# EasyEDA Pro project musclemap_pcb_header.eprj, board PCB2
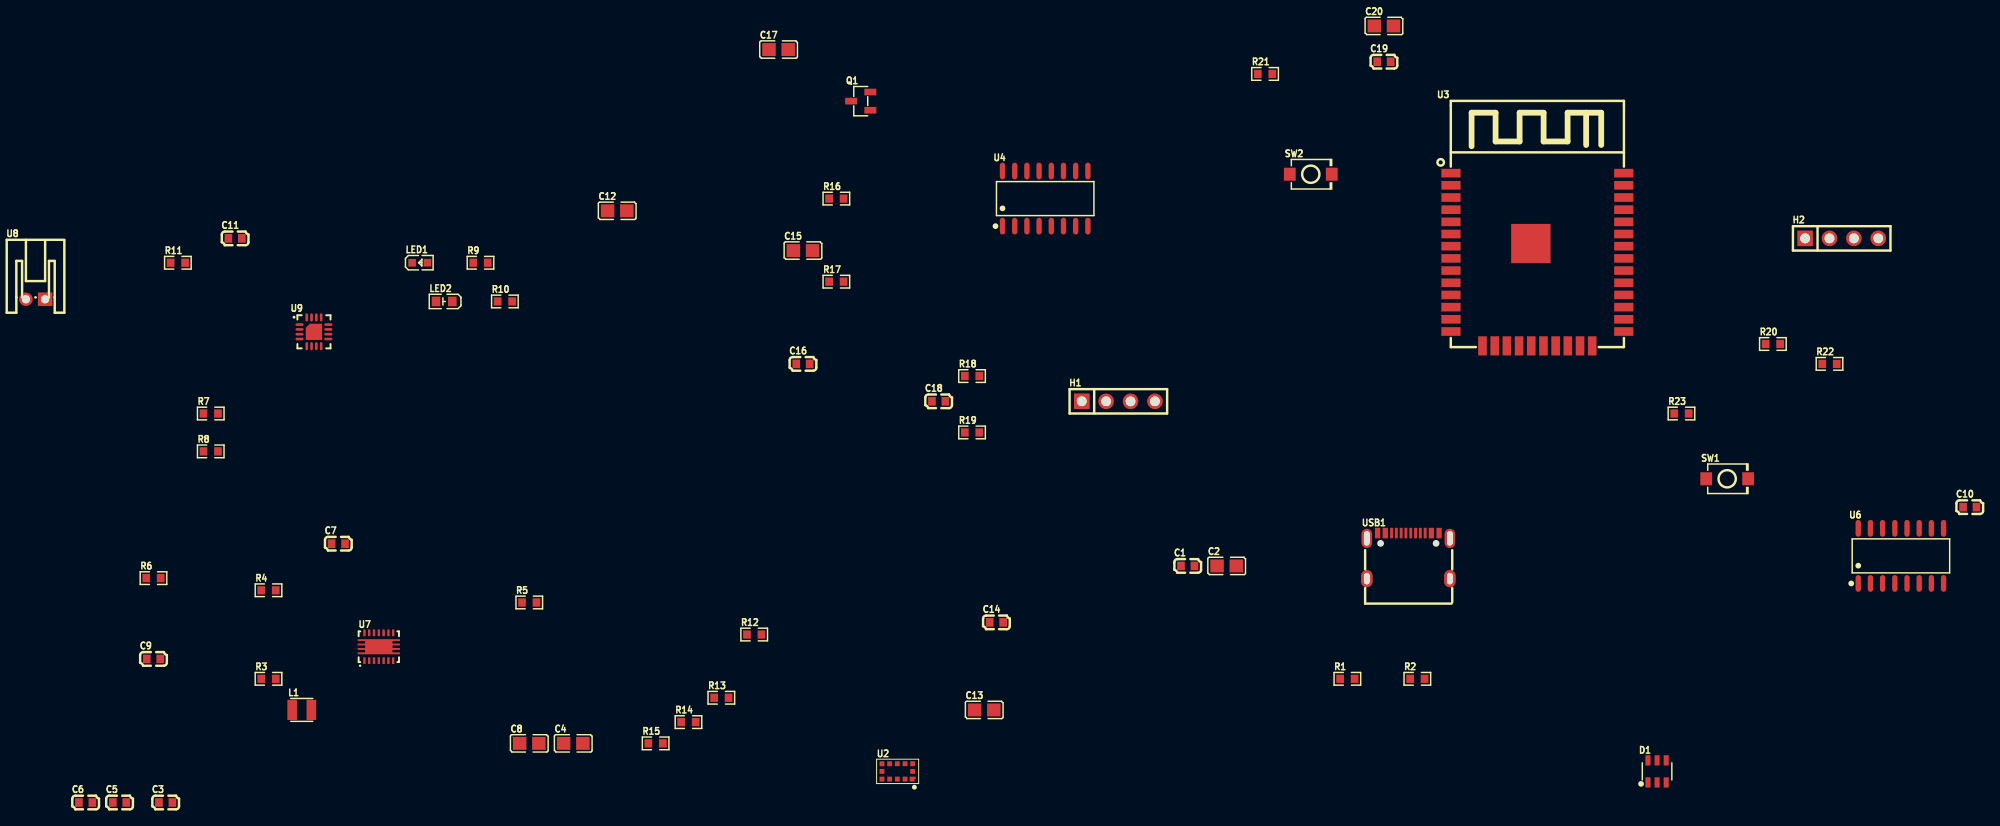
[diagram p3: board, top side]
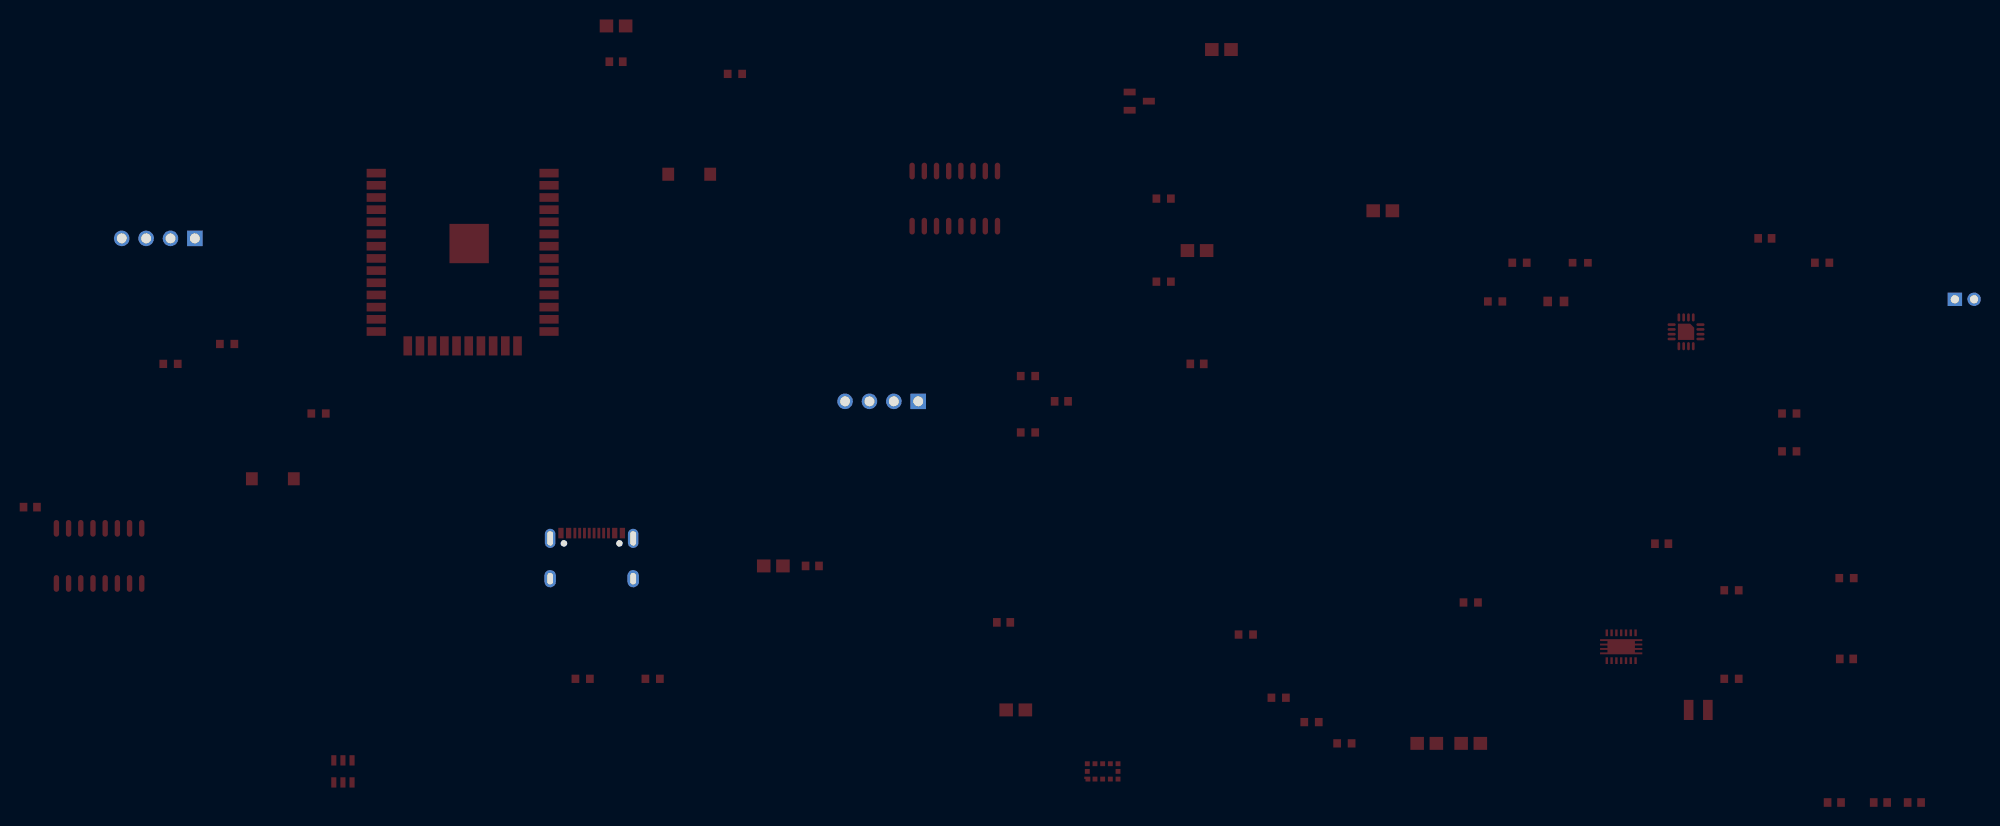
[diagram p4: board, bottom side, seen from below]

Outline 6.47 x 0.69 mm; copper layers: Top Layer, Bottom Layer. Coordinates in mm from the lower left corner of the outline.
Stack: Top Layer 0.035mm / Dielectric1 1.51mm FR4 er 4.5 / Bottom Layer 0.035mm

## Design rules (mm)
template: JLCPCB Capability(Two Layers Board)
spacing copperThickness1oz (default): track to track 0.102, other pairs 0.152 to 0.3
spacing copperThickness2oz: track to track 0.203, other pairs 0.152 to 0.3
track width copperThickness1oz (default): min 0.127, default 0.254, max 2.54
track width copperThickness2oz: min 0.203, default 0.254, max 2.54
differential pair differentialPair (default): width min 0.127, default 0.254, max 2.54; gap min 0.152, default 0.152
via viaSize (default): diameter min 0.5, default 0.61, max 10; hole min 0.3, default 0.305, max 6.3

## Placement (name value [footprint] x y rotation side)
C1  100nF  [C0603]  -19.74 -2 0 top
C2  10uF  [C0805]  -15.68 -2 0 top
C3  22uF  [C0603]  -126.19 -26.67 0 top
C4  10uF  [C0805]  -83.74 -20.5 0 top
C5  22uF  [C0603]  -131 -26.67 0 top
C6  22uF  [C0603]  -134.53 -26.67 0 top
C7  100nF  [C0603]  -108.21 0.31 0 top
C8  10uF  [C0805]  -88.32 -20.5 0 top
C9  4.7pF  [C0603]  -127.46 -11.7 0 top
C10  100nF  [C0603]  61.71 4.12 0 top
C11  1uF  [C0603]  -118.96 32.14 0 top
C12  4.7uF  [C0805]  -79.16 35.02 0 top
C13  4.7uF  [C0805]  -40.94 -17.02 0 top
C14  100nF  [C0603]  -39.67 -7.89 0 top
C15  10uF  [C0805]  -59.82 30.87 0 top
C16  100nF  [C0603]  -59.82 19.06 0 top
C17  10uF  [C0805]  -62.36 51.83 0 top
C18  100nF  [C0603]  -45.68 15.16 0 top
C19  100nF  [C0603]  0.7 50.56 0 top
C20  10uF  [C0805]  0.7 54.29 0 top
D1  USBLC6-2SC6  [SOT-23-6_L2.9-W1.6-P0.95-LS2.8-BL]  29.14 -23.42 0 top
H1  HX PH254-01-04-Z-L11.5 straight pin header  [HDR-TH_4P-HX-PH254-01-04-Z-L11.5]  -26.97 15.16 0 top
H2  HX PH254-01-04-Z-L11.5 straight pin header  [HDR-TH_4P-HX-PH254-01-04-Z-L11.5]  48.38 32.14 0 top
L1  1.5uH  [IND-SMD_L2.5-W2.0_MEKK2520TR47M]  -112.02 -17.02 0 top
LED1  XL-1608SURC-06  [LED0603-RD_RED]  -99.73 29.6 0 top
LED2  YLED0603B  [LED0603-FD]  -97.19 25.57 0 top
Q1  BC807-40,215  [SOT-23-3_L2.9-W1.3-P1.90-LS2.4-BR]  -53.8 46.45 0 top
R1  5.1kΩ  [R0603]  -3.11 -13.77 0 top
R2  5.1kΩ  [R0603]  4.18 -13.77 0 top
R3  180kΩ  [R0603]  -115.48 -13.77 0 top
R4  1MΩ  [R0603]  -115.48 -4.54 0 top
R5  1MΩ  [R0603]  -88.32 -5.81 0 top
R6  68kΩ  [R0603]  -127.46 -3.27 0 top
R7  1.18kΩ  [R0603]  -121.5 13.89 0 top
R8  1.13kΩ  [R0603]  -121.5 9.94 0 top
R9  1kΩ  [R0603]  -93.4 29.6 0 top
R10  1kΩ  [R0603]  -90.86 25.57 0 top
R11  10kΩ  [R0603]  -124.92 29.6 0 top
R12  3.6kΩ  [R0603]  -64.9 -9.16 0 top
R13  3.6kΩ  [R0603]  -68.32 -15.75 0 top
R14  3.6kΩ  [R0603]  -71.74 -18.29 0 top
R15  3.6kΩ  [R0603]  -75.16 -20.5 0 top
R16  20kΩ  [R0603]  -56.34 36.29 0 top
R17  8.2kΩ  [R0603]  -56.34 27.63 0 top
R18  100Ω  [R0603]  -42.21 17.79 0 top
R19  100Ω  [R0603]  -42.21 11.91 0 top
R20  10kΩ  [R0603]  41.21 21.13 0 top
R21  10kΩ  [R0603]  -11.68 49.29 0 top
R22  10kΩ  [R0603]  47.11 19.06 0 top
R23  10kΩ  [R0603]  31.68 13.89 0 top
SW1  TS-1088-AR02016  [SW-SMD_L3.9-W3.0-P4.45]  36.45 7.08 0 top
SW2  TS-1088-AR02016  [SW-SMD_L3.9-W3.0-P4.45]  -6.92 38.83 0 top
U2  VL53L4CDV0DH/1  [LGA-12_L4.4-W2.4_VL53L0X]  -49.99 -23.42 0 top
U3  ESP32-WROOM-32-N4  [WIFIM-SMD_ESP32-WROOM-32-N4]  16.68 29.94 0 top
U4  HX711  [SOP-16_L10.0-W3.9-P1.27-LS6.0-BL]  -34.59 36.29 0 top
U6  CH340C  [SOP-16_L10.0-W3.9-P1.27-LS6.0-BL]  54.54 -0.96 0 top
U7  TPS63020DSJT  [VSON-14_L4.0-W3.0-P0.50-BL-EP_TI_DSJ]  -103.99 -10.43 0 top
U8  S2B-PH-K-S(LF)(SN)  [CONN-TH_S2B-PH-K-S-LF-SN]  -139.75 25.79 0 top
U9  BQ24075RGTR  [QFN-16_L3.0-W3.0-P0.50-TL-EP1.7]  -110.75 22.4 0 top
USB1  TYPE-C 16PIN 2MD(073)  [USB-C-SMD_TYPE-C-6PIN-2MD-073]  3.24 -0.96 0 top

## Footprints (pads in the part's own frame, mm; a bottom-side part is the same pattern mirrored in y, then rotated)
C0603
  rect 0.8x0.9 smd: 1(-0.7,0) 2(0.7,0)
C0805
  rect 1.41x1.35 smd: 1(-1,0) 2(1,0)
CONN-TH_S2B-PH-K-S-LF-SN
  rect 1.5x1.4 hole 0.85: 1(1,0)
  round 1.4 hole 0.85: 2(-1,0)
HDR-TH_4P-HX-PH254-01-04-Z-L11.5
  rect 1.62x1.62 hole 1.02: 1(-3.81,0)
  round 1.62 hole 1.02: 2(-1.27,0) 3(1.27,0) 4(3.81,0)
IND-SMD_L2.5-W2.0_MEKK2520TR47M
  rect 1x2.1 smd: 1(1,0) 2(-1,0)
LED0603-FD
  rect 0.9x1 smd: 1(-0.85,0) 2(0.85,0)
LED0603-RD_RED
  rect 0.8x0.8 smd: 1(-0.799,-0.004) 2(0.799,0.004)
LGA-12_L4.4-W2.4_VL53L0X
  custom 0.635x0.508 smd: 1(1.6,-0.8)
  rect 0.508x0.508 smd: 2(0.8,-0.8) 3(0,-0.8) 4(-0.8,-0.8) 5(-1.6,-0.8) 6(-1.6,0) 7(-1.6,0.8) 8(-0.8,0.8) 9(0,0.8) 10(0.8,0.8) 11(1.6,0.8) 12(1.6,0)
QFN-16_L3.0-W3.0-P0.50-TL-EP1.7
  oval 0.85x0.28 smd: 1(-1.5,0.75) 2(-1.5,0.25) 3(-1.5,-0.25) 4(-1.5,-0.75) 9(1.5,-0.75) 10(1.5,-0.25) 11(1.5,0.25) 12(1.5,0.75)
  oval 0.28x0.85 smd: 5(-0.75,-1.5) 6(-0.25,-1.5) 7(0.25,-1.5) 8(0.75,-1.5) 13(0.75,1.5) 14(0.25,1.5) 15(-0.25,1.5) 16(-0.75,1.5)
  custom 1.7x1.7 smd: 17(0,0)
R0603
  rect 0.806x0.864 smd: 1(-0.753,0) 2(0.753,0)
SOP-16_L10.0-W3.9-P1.27-LS6.0-BL
  oval 0.56x1.745 smd: 1(-4.445,-2.873) 2(-3.175,-2.873) 3(-1.905,-2.873) 4(-0.635,-2.873) 5(0.635,-2.873) 6(1.905,-2.873) 7(3.175,-2.873) 8(4.445,-2.873) 9(4.445,2.873) 10(3.175,2.873) 11(1.905,2.873) 12(0.635,2.873) 13(-0.635,2.873) 14(-1.905,2.873) 15(-3.175,2.873) 16(-4.445,2.873)
SOT-23-3_L2.9-W1.3-P1.90-LS2.4-BR
  rect 1.25x0.7 smd: 1(1,-0.95) 2(1,0.95) 3(-1,0)
SOT-23-6_L2.9-W1.6-P0.95-LS2.8-BL
  rect 0.532x1.072 smd: 1(-0.95,-1.149) 2(0,-1.149) 3(0.95,-1.149) 4(0.95,1.149) 5(0,1.149) 6(-0.95,1.149)
SW-SMD_L3.9-W3.0-P4.45
  rect 1.23x1.36 smd: 1(-2.185,0) 2(2.185,0)
USB-C-SMD_TYPE-C-6PIN-2MD-073
  rect 0.55x1.1 smd: 1(-3.2,2.375) 2(-2.4,2.375) 11(2.4,2.375) 12(3.2,2.375)
  rect 0.3x1.1 smd: 3(-1.75,2.375) 4(-1.25,2.375) 5(-0.75,2.375) 6(-0.25,2.375) 7(0.25,2.375) 8(0.75,2.375) 9(1.25,2.375) 10(1.75,2.375)
  oval 1.1x2 hole 0.6x1.5: 13(-4.325,1.825) 14(4.325,1.825)
  oval 1.2x1.8 hole 0.6x1.2: 13(-4.325,-2.375) 14(4.325,-2.375)
VSON-14_L4.0-W3.0-P0.50-BL-EP_TI_DSJ
  rect 0.25x0.7 smd: 1(-1.5,-1.45) 2(-1,-1.45) 3(-0.5,-1.45) 4(0,-1.45) 5(0.5,-1.45) 6(1,-1.45) 7(1.5,-1.45) 8(1.5,1.45) 9(1,1.45) 10(0.5,1.45) 11(0,1.45) 12(-0.5,1.45) 13(-1,1.45) 14(-1.5,1.45)
  custom 4.4x1.58 smd: 15(0,0)
WIFIM-SMD_ESP32-WROOM-32-N4
  rect 2x0.9 smd: 1(-9,9.005) 2(-9,7.735) 3(-9,6.465) 4(-9,5.195) 5(-9,3.925) 6(-9,2.655) 7(-9,1.385) 8(-9,0.115) 9(-9,-1.155) 10(-9,-2.425) 11(-9,-3.695) 12(-9,-4.965) 13(-9,-6.235) 14(-9,-7.505) 25(9,-7.505) 26(9,-6.235) 27(9,-4.965) 28(9,-3.695) 29(9,-2.425) 30(9,-1.155) 31(9,0.115) 32(9,1.385) 33(9,2.655) 34(9,3.925) 35(9,5.195) 36(9,6.465) 37(9,7.735) 38(9,9.005)
  rect 0.9x2 smd: 15(-5.715,-9.005) 16(-4.445,-9.005) 17(-3.175,-9.005) 18(-1.905,-9.005) 19(-0.635,-9.005) 20(0.635,-9.005) 21(1.905,-9.005) 22(3.175,-9.005) 23(4.445,-9.005) 24(5.715,-9.005)
  rect 4.1x4.1 smd: 39(-0.68,1.665)

## Nets
3.3V: C3.2 C5.2 C6.2 C10.1 C13.2 C14.2 C19.1 C20.1 H2.4 R4.2 R5.2 R6.2 R12.2 R13.2 R14.2 R15.2 R20.2 R21.1 R22.2 U2.1 U2.11 U3.2 U6.16 U7.4 U7.5
GND: C1.1 C2.1 C3.1 C4.2 C5.1 C6.1 C7.2 C8.2 C10.2 C11.1 C12.1 C13.1 C14.1 C15.1 C16.2 C17.2 C19.2 C20.2 D1.2 H1.2 H2.1 H2.3 R1.1 R2.1 R3.1 R7.1 R8.1 R11.1 R17.1 R23.1 SW1.1 SW2.1 U2.2 U2.3 U2.4 U2.6 U2.12 U3.1 U3.15 U3.38 U3.39 U4.5 U4.9 U4.10 U4.15 U6.1 U7.2 U7.15 U8.2 U9.4 U9.6 U9.8 U9.14 USB1.1 USB1.12 USB1.13 USB1.14
VBUS: C1.2 C2.2 C11.2 D1.5 U9.13 USB1.2 USB1.11
32: U3.8 U4.11
34: U3.6 U4.12
D+: D1.3 USB1.6 USB1.8
D+_U: D1.4 U6.5
D-: D1.1 USB1.5 USB1.7
D-_U: D1.6 U6.6
RX: U3.34 U6.2
SCL: R15.1 U2.10 U3.36
SDA: R14.1 U2.9 U3.33
TX: U3.35 U6.3
VOUT: C4.1 C8.1 C12.2 R9.2 R10.2 U7.10 U7.11 U9.5 U9.10 U9.11
XSHUT: R12.1 U2.5 U3.10
$1N1499: R1.2 USB1.4
$1N1538: R2.2 USB1.10
$1N2804: L1.1 U7.8 U7.9
$1N2809: L1.2 U7.6 U7.7
$1N2919: R5.1 U7.14
$1N3098: C7.1 U7.1 U7.12 U7.13
$1N3230: C9.1 R3.2 R4.1 U7.3
$1N3482: C9.2 R6.1
$1N4163: R7.2 U9.12
$1N4202: R8.2 U9.16
$1N4584: LED1.1 U9.9
$1N4586: LED1.2 R9.1
$1N4675: LED2.2 U9.7
$1N4721: LED2.1 R10.1
$1N4792: R11.2 U9.1
$1N4858: U8.1 U9.2 U9.3
$1N5175: R13.1 U2.7
$1N5467: C17.1 Q1.2 U4.1 U4.16
$1N5724: R16.1 R17.2 U4.4
$1N5741: Q1.1 U4.2
$1N5746: C15.2 H1.1 Q1.3 R16.2 U4.3
$1N5829: C16.1 U4.6
$1N6086: C18.2 R18.1 U4.8
$1N6088: C18.1 R19.1 U4.7
$1N6257: H1.3 R18.2
$1N6263: H1.4 R19.2
$1N6579: R20.1 SW1.2 U3.25
$1N6780: R21.2 SW2.2 U3.3
$1N6891: R22.1 U3.24
$1N6937: R23.2 U3.23
$1N7024: H2.2 U3.30

Pads without a net: U2 8; U3 4 5 7 9 11 12 13 14 16 17 18 19 20 21 22 26 27 28 29 31 32 37; U4 13 14; U6 4 7 8 9 10 11 12 13 14 15; U9 15 17; USB1 3 9
